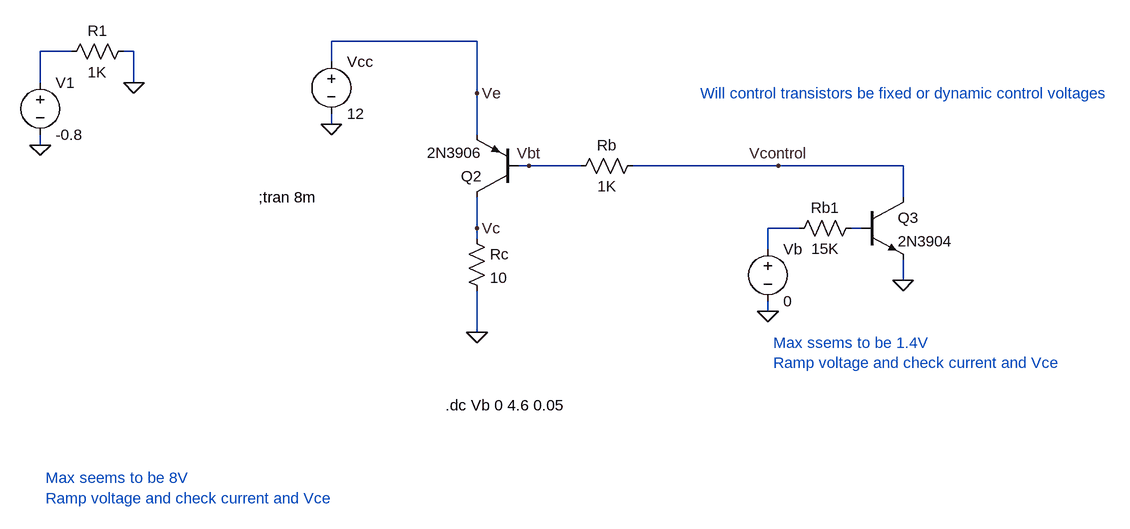
[diagram p0: schematic PNP Configuration - test.asc]
PNP Configuration - test.asc, the LTspice schematic file:
Version 4
SHEET 1 1576 804
WIRE 96 0 -128 0
WIRE -528 16 -576 16
WIRE -432 16 -448 16
WIRE -128 32 -128 0
WIRE -576 64 -576 16
WIRE -432 64 -432 16
WIRE 96 80 96 0
WIRE -128 128 -128 112
WIRE 96 144 96 80
WIRE -576 160 -576 144
WIRE 176 192 160 192
WIRE 256 192 176 192
WIRE 560 192 336 192
WIRE 752 192 560 192
WIRE 752 240 752 192
WIRE 96 288 96 240
WIRE 592 288 544 288
WIRE 688 288 672 288
WIRE 96 304 96 288
WIRE 544 320 544 288
WIRE 752 368 752 336
WIRE 544 416 544 400
WIRE 96 448 96 384
FLAG 96 80 Ve
FLAG 96 288 Vc
FLAG 176 192 Vbt
FLAG 96 448 0
FLAG -128 128 0
FLAG 752 368 0
FLAG 544 416 0
FLAG 560 192 Vcontrol
FLAG -576 160 0
FLAG -432 64 0
SYMBOL pnp 160 240 R180
SYMATTR InstName Q2
SYMATTR Value 2N3906
SYMBOL res 352 176 R90
WINDOW 0 0 56 VBottom 2
WINDOW 3 32 56 VTop 2
SYMATTR InstName Rb
SYMATTR Value 1K
SYMBOL res 80 288 R0
SYMATTR InstName Rc
SYMATTR Value 10
SYMBOL npn 688 240 R0
SYMATTR InstName Q3
SYMATTR Value 2N3904
SYMBOL res 688 272 R90
WINDOW 0 0 56 VBottom 2
WINDOW 3 32 56 VTop 2
SYMATTR InstName Rb1
SYMATTR Value 15K
SYMBOL voltage -128 16 R0
WINDOW 123 0 0 Left 2
WINDOW 39 0 0 Left 2
SYMATTR InstName Vcc
SYMATTR Value 12
SYMBOL voltage 544 304 R0
WINDOW 123 0 0 Left 2
WINDOW 39 0 0 Left 2
SYMATTR InstName Vb
SYMATTR Value 0
SYMBOL voltage -576 48 R0
WINDOW 123 0 0 Left 2
WINDOW 39 24 124 Left 2
SYMATTR InstName V1
SYMATTR Value -0.8
SYMBOL res -432 0 R90
WINDOW 0 0 56 VBottom 2
WINDOW 3 32 56 VTop 2
SYMATTR InstName R1
SYMATTR Value 1K
TEXT -240 240 Left 2 !;tran 8m
TEXT 552 464 Left 2 ;Max ssems to be 1.4V\nRamp voltage and check current and Vce
TEXT -568 672 Left 2 ;Max seems to be 8V\nRamp voltage and check current and Vce
TEXT 440 80 Left 2 ;Will control transistors be fixed or dynamic control voltages
TEXT 48 560 Left 2 !.dc Vb 0 4.6 0.05

The netlist it stands for:
* PNP Configuration - test.asc
Q2 Vc Vbt Ve 0 2N3906
Rb Vcontrol Vbt 1K
Rc Vc 0 10
Q3 Vcontrol N003 0 0 2N3904
Rb1 N003 N002 15K
Vcc Ve 0 12
Vb N002 0 0
V1 N001 0 -0.8
R1 0 N001 1K
.model NPN NPN
.model PNP PNP
.lib standard.bjt
;tran 8m
* Max ssems to be 1.4V
* Ramp voltage and check current and Vce
* Max seems to be 8V
* Ramp voltage and check current and Vce
* Will control transistors be fixed or dynamic control voltages
.dc Vb 0 4.6 0.05
.backanno
.end